# Altium schematic sheet ISO_UART.SchDoc
size A4
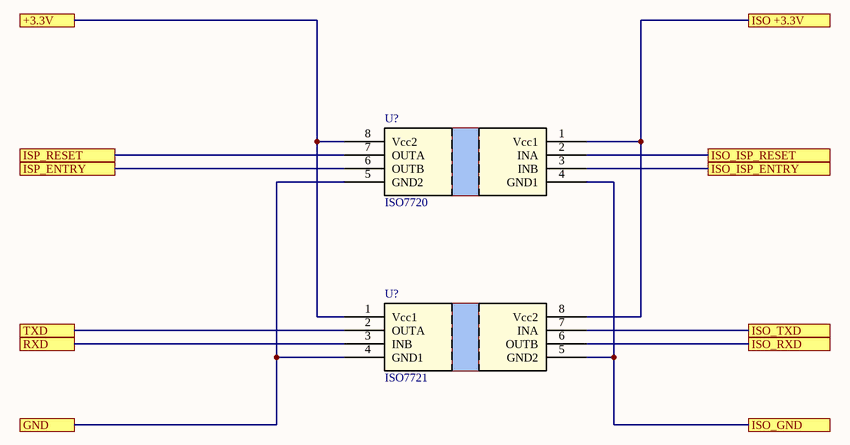
[diagram p0: ISO_UART.SchDoc]

## Parts
(Parts that share a designator on the sheet are numbered #1, #2 ... from top to bottom, then left to right.)
U?#1  ISO7720  [SOIC-8]
U?#2  ISO7721  [SOIC-8]

## Ports
+3.3V, GND, ISO +3.3V, ISO_GND, ISO_ISP_ENTRY, ISO_ISP_RESET, ISO_RXD, ISO_TXD, ISP_ENTRY, ISP_RESET, RXD, TXD

## Nets
+3.3V: U?#1.8(Vcc2) U?#2.1(Vcc1) ; port +3.3V
GND: U?#1.5(GND2) U?#2.4(GND1) ; port GND
ISO +3.3V: U?#1.1(Vcc1) U?#2.8(Vcc2) ; port ISO +3.3V
ISO_GND: U?#1.4(GND1) U?#2.5(GND2) ; port ISO_GND
ISO_ISP_ENTRY: U?#1.3(INB) ; port ISO_ISP_ENTRY
ISO_ISP_RESET: U?#1.2(INA) ; port ISO_ISP_RESET
ISO_RXD: U?#2.6(OUTB) ; port ISO_RXD
ISO_TXD: U?#2.7(INA) ; port ISO_TXD
ISP_ENTRY: U?#1.6(OUTB) ; port ISP_ENTRY
ISP_RESET: U?#1.7(OUTA) ; port ISP_RESET
RXD: U?#2.3(INB) ; port RXD
TXD: U?#2.2(OUTA) ; port TXD

## Library data of the parts
U?#1 = ISO7720-Q1: Dual channel digital isolator. High data rate up to 100 Mbps; Mfr_Name: Microchip; Manufacturer_Part_Number: MCP41010T-E/SN; Manufacturer: TI; Copyright: Copyright (C) 2021 Ultra Librarian. All rights reserved.; RefDes: RefDes; Type: DEV; Part Number: ISO7720-Q1; Author: Sun; DateModification: 15.02.2022; ManufacturerPartNumber: ISO7720; Package: SOIC-8
U?#2 = ISO7721-Q1: Dual channel digital isolator. High data rate up to 100 Mbps; Mfr_Name: Microchip; Manufacturer_Part_Number: MCP41010T-E/SN; Manufacturer: TI; ManufacturerPartNumber: ISO7720; Copyright: Copyright (C) 2021 Ultra Librarian. All rights reserved.; RefDes: RefDes; Type: DEV; Part Number: ISO7721-Q1; Author: Sun; DateModification: 15.02.2022; Package: SOIC-8